# EAGLE design G020X (EAGLE 6.6.0)
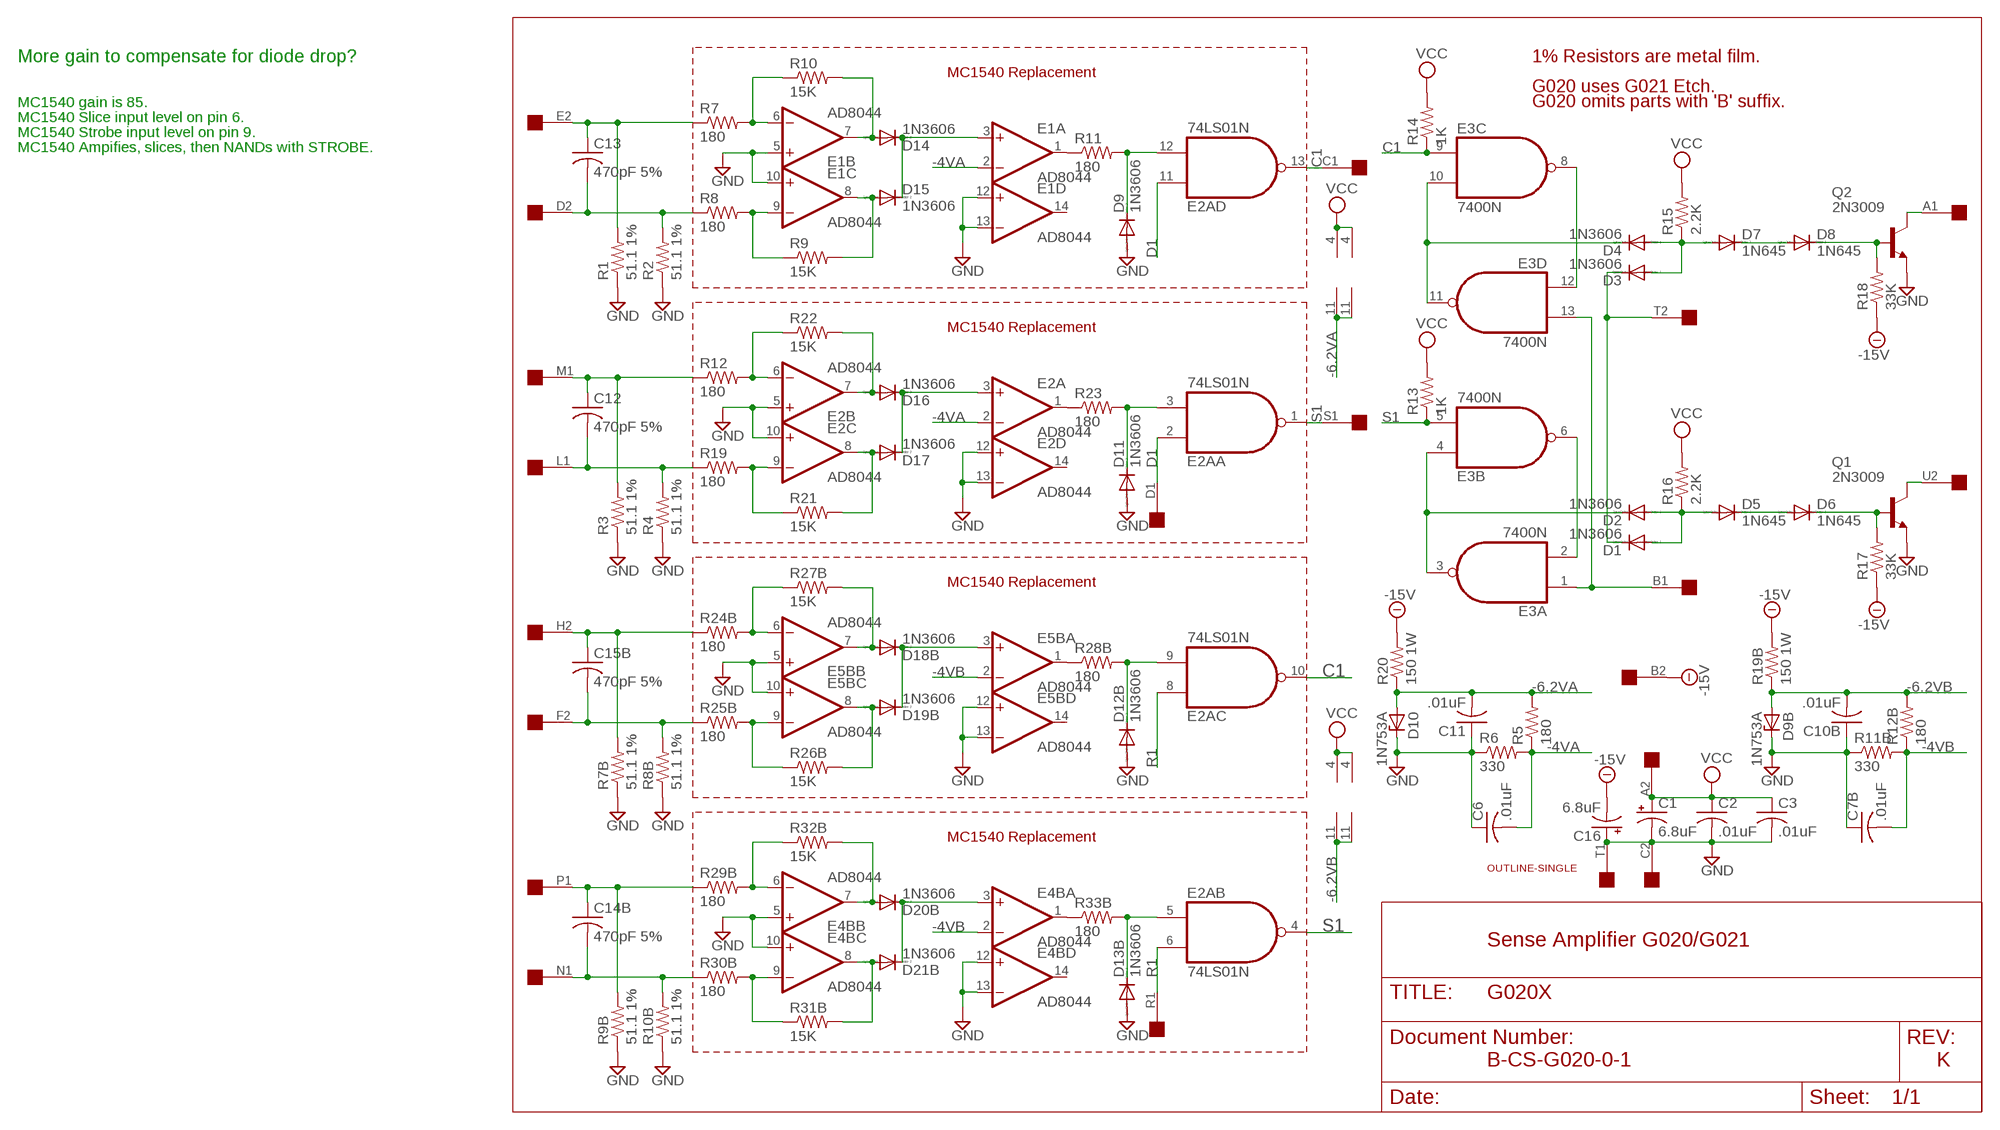
[diagram p0: schematic, sheet 1]

## Parts
C1  6.8uF  CPOL-USE20-8AXIAL  [E12-8]
C2  .01uF  C-US050-025X075  [C050-025X075]
C3  .01uF  C-US050-025X075  [C050-025X075]
C6  .01uF  C-US050-025X075  [C050-025X075]
C7B  .01uF  C-US050-025X075  [C050-025X075]
C10B  .01uF  C-US050-025X075  [C050-025X075]
C11  .01uF  C-US050-025X075  [C050-025X075]
C12  470pF 5%  C-US050-025X075  [C050-025X075]
C13  470pF 5%  C-US050-025X075  [C050-025X075]
C14B  470pF 5%  C-US050-025X075  [C050-025X075]
C15B  470pF 5%  C-US050-025X075  [C050-025X075]
C16  6.8uF  CPOL-USE20-8AXIAL  [E12-8]
D1  1N3606  1N4148DO35-10  [DO35-10]
D2  1N3606  1N4148DO35-10  [DO35-10]
D3  1N3606  1N4148DO35-10  [DO35-10]
D4  1N3606  1N4148DO35-10  [DO35-10]
D5  1N645  1N4148DO35-10  [DO35-10]
D6  1N645  1N4148DO35-10  [DO35-10]
D7  1N645  1N4148DO35-10  [DO35-10]
D8  1N645  1N4148DO35-10  [DO35-10]
D9  1N3606  1N4148DO35-10  [DO35-10]
D9B  1N753A  ZENER-DIODEDO35Z10  [DO35Z10]
D10  1N753A  ZENER-DIODEDO35Z10  [DO35Z10]
D11  1N3606  1N4148DO35-10  [DO35-10]
D12B  1N3606  1N4148DO35-10  [DO35-10]
D13B  1N3606  1N4148DO35-10  [DO35-10]
D14  1N3606  1N4148DO35-10  [DO35-10]
D15  1N3606  1N4148DO35-10  [DO35-10]
D16  1N3606  1N4148DO35-10  [DO35-10]
D17  1N3606  1N4148DO35-10  [DO35-10]
D18B  1N3606  1N4148DO35-10  [DO35-10]
D19B  1N3606  1N4148DO35-10  [DO35-10]
D20B  1N3606  1N4148DO35-10  [DO35-10]
D21B  1N3606  1N4148DO35-10  [DO35-10]
E1  AD8044  4AMP_P4+11N  [DIL14]
E2  AD8044  4AMP_P4+11N  [DIL14]
E2A  74LS01N  [DIL14]
E3  7400N  [DIL14]
E4B  AD8044  4AMP_P4+11N  [DIL14]
E5B  AD8044  4AMP_P4+11N  [DIL14]
Q1  2N3009  2N2219  [TO5]
Q2  2N3009  2N2219  [TO5]
R1  51.1 1%  R-US_0207/10  [0207/10]
R2  51.1 1%  R-US_0207/10  [0207/10]
R3  51.1 1%  R-US_0207/10  [0207/10]
R4  51.1 1%  R-US_0207/10  [0207/10]
R5  180  R-US_0207/10  [0207/10]
R6  330  R-US_0207/10  [0207/10]
R7  180  R-US_0207/10  [0207/10]
R7B  51.1 1%  R-US_0207/10  [0207/10]
R8  180  R-US_0207/10  [0207/10]
R8B  51.1 1%  R-US_0207/10  [0207/10]
R9  15K  R-US_0207/10  [0207/10]
R9B  51.1 1%  R-US_0207/10  [0207/10]
R10  15K  R-US_0207/10  [0207/10]
R10B  51.1 1%  R-US_0207/10  [0207/10]
R11  180  R-US_0207/10  [0207/10]
R11B  330  R-US_0207/10  [0207/10]
R12  180  R-US_0207/10  [0207/10]
R12B  180  R-US_0207/10  [0207/10]
R13  1K  R-US_0207/10  [0207/10]
R14  1K  R-US_0207/10  [0207/10]
R15  2.2K  R-US_0207/10  [0207/10]
R16  2.2K  R-US_0207/10  [0207/10]
R17  33K  R-US_0207/10  [0207/10]
R18  33K  R-US_0207/10  [0207/10]
R19  180  R-US_0207/10  [0207/10]
R19B  150 1W  R-US_0414/20  [0414/20]
R20  150 1W  R-US_0414/20  [0414/20]
R21  15K  R-US_0207/10  [0207/10]
R22  15K  R-US_0207/10  [0207/10]
R23  180  R-US_0207/10  [0207/10]
R24B  180  R-US_0207/10  [0207/10]
R25B  180  R-US_0207/10  [0207/10]
R26B  15K  R-US_0207/10  [0207/10]
R27B  15K  R-US_0207/10  [0207/10]
R28B  180  R-US_0207/10  [0207/10]
R29B  180  R-US_0207/10  [0207/10]
R30B  180  R-US_0207/10  [0207/10]
R31B  15K  R-US_0207/10  [0207/10]
R32B  15K  R-US_0207/10  [0207/10]
R33B  180  R-US_0207/10  [0207/10]
U$1  SINGLE  [EDGE-CON2]
U$2  OUTLINE-SINGLE  [SINGLE]

## Nets
-4VA: C6.2 E1.2(A:-IN) E2.2(A:-IN) R5.1 R6.2
-4VB: C7B.2 E4B.2(A:-IN) E5B.2(A:-IN) R11B.2 R12B.1
-6.2VA: C11.2 D10.A E1.11(P:V-) E2.11(P:V-) R5.2 R20.1
-6.2VB: C10B.2 D9B.A E4B.11(P:V-) E5B.11(P:V-) R12B.2 R19B.1
-15V [Supply]: C16.- R17.1 R18.1 R19B.2 R20.2 U$1.B2
A1: Q2.3(C) U$1.A1
B1: E3.1(A:I0) E3.13(D:I1) U$1.B1
C1: E2A.10(C:O) E2A.13(D:O) E3.9(C:I0) R14.1 U$1.C1
D1: E2A.2(A:I0) E2A.11(D:I0) U$1.D1
D2: C13.2 R2.2 R8.1 U$1.D2
E2: C13.1 R1.2 R7.1 U$1.E2
F2: C15B.2 R8B.2 R25B.1 U$1.F2
GND [Supply]: C1.- C2.2 C3.2 C6.1 C7B.1 C10B.1 C11.1 C16.+ D9.A D9B.C D10.C D11.A D12B.A D13B.A E1.5(B:+IN) E1.10(C:+IN) E1.12(D:+IN) E1.13(D:-IN) E2.5(B:+IN) E2.10(C:+IN) E2.12(D:+IN) E2.13(D:-IN) E4B.5(B:+IN) E4B.10(C:+IN) E4B.12(D:+IN) E4B.13(D:-IN) E5B.5(B:+IN) E5B.10(C:+IN) E5B.12(D:+IN) E5B.13(D:-IN) Q1.1(E) Q2.1(E) R1.1 R2.1 R3.1 R4.1 R6.1 R7B.1 R8B.1 R9B.1 R10B.1 R11B.1 U$1.C2 U$1.T1
H2: C15B.1 R7B.2 R24B.1 U$1.H2
L1: C12.2 R4.2 R19.1 U$1.L1
M1: C12.1 R3.2 R12.1 U$1.M1
N1: C14B.2 R10B.2 R30B.1 U$1.N1
N$1: D20B.C D21B.C E4B.3(A:+IN)
N$2: D18B.C D19B.C E5B.3(A:+IN)
N$5: E3.8(C:O) E3.12(D:I0)
N$6: D1.A D2.A D5.A R16.1
N$7: D4.C E3.10(C:I1) E3.11(D:O)
N$8: D2.C E3.3(A:O) E3.4(B:I0)
N$9: E3.2(A:I1) E3.6(B:O)
N$10: D3.A D4.A D7.A R15.1
N$11: D7.C D8.A
N$12: D5.C D6.A
N$13: D8.C Q2.2(B) R18.2
N$14: D6.C Q1.2(B) R17.2
N$15: E1.6(B:-IN) R7.2 R10.1
N$16: E1.9(C:-IN) R8.2 R9.1
N$17: D14.C D15.C E1.3(A:+IN)
N$19: E1.1(A:OUT) R11.1
N$20: D9.C E2A.12(D:I1) R11.2
N$21: D15.A E1.8(C:OUT) R9.2
N$22: E2.6(B:-IN) R12.2 R22.1
N$23: E2.9(C:-IN) R19.2 R21.1
N$24: D16.A E2.7(B:OUT) R22.2
N$26: E2.1(A:OUT) R23.1
N$27: D11.C E2A.3(A:I1) R23.2
N$29: E5B.6(B:-IN) R24B.2 R27B.1
N$30: E5B.9(C:-IN) R25B.2 R26B.1
N$31: D18B.A E5B.7(B:OUT) R27B.2
N$32: D14.A E1.7(B:OUT) R10.2
N$33: E5B.1(A:OUT) R28B.1
N$34: D12B.C E2A.9(C:I1) R28B.2
N$35: D17.A E2.8(C:OUT) R21.2
N$36: E4B.6(B:-IN) R29B.2 R32B.1
N$37: D19B.A E5B.8(C:OUT) R26B.2
N$38: D20B.A E4B.7(B:OUT) R32B.2
N$39: E4B.1(A:OUT) R33B.1
N$40: E4B.9(C:-IN) R30B.2 R31B.1
N$41: D13B.C E2A.5(B:I0) R33B.2
N$42: D16.C D17.C E2.3(A:+IN)
N$43: D21B.A E4B.8(C:OUT) R31B.2
P1: C14B.1 R9B.2 R29B.1 U$1.P1
R1: E2A.6(B:I1) E2A.8(C:I0) U$1.R1
S1: E2A.1(A:O) E2A.4(B:O) E3.5(B:I1) R13.1 U$1.S1
T2: D1.C D3.C U$1.T2
U2: Q1.3(C) U$1.U2
VCC [Supply]: C1.+ C2.1 C3.1 E1.4(P:V+) E2.4(P:V+) E4B.4(P:V+) E5B.4(P:V+) R13.2 R14.2 R15.2 R16.2 U$1.A2
Unconnected: E1.14(D:OUT) E2.14(D:OUT) E4B.14(D:OUT) E5B.14(D:OUT) U$1.E1 U$1.F1 U$1.H1 U$1.J1 U$1.J2 U$1.K1 U$1.K2 U$1.L2 U$1.M2 U$1.N2 U$1.P2 U$1.R2 U$1.S2 U$1.U1 U$1.V1 U$1.V2

## Notes on the sheet
- More gain to compensate for diode drop? | 1% Resistors are metal film.
- MC1540 Replacement
- G020 uses G021 Etch.
- MC1540 gain is 85. | G020 omits parts with 'B' suffix.
- MC1540 Slice input level on pin 6.
- MC1540 Strobe input level on pin 9.
- MC1540 Ampifies, slices, then NANDs with STROBE.
- MC1540 Replacement
- MC1540 Replacement
- MC1540 Replacement
- Sense Amplifier G020/G021
- B-CS-G020-0-1 | K

## Power pins joined to a net without a drawn wire
GND: E2A.7(P:GND) E3.7(P:GND)
VCC: E2A.14(P:VCC) E3.14(P:VCC)

## Library data of the parts
C1 C16 = dec-con:CPOL-USE20-8AXIAL: A 0.8 inch electrolytic.
C2 C3 C6 C7B C10B C11-C13 C14B C15B = rcl:C-US: CAPACITOR, American symbol
D1-D9 D11 D12B D13B D14-D17 D18B D19B D20B D21B = diode:1N4148: DIODE high speed (Philips)
D9B D10 = diode:ZENER-DIODE: Z-Diode
E1 E2 E4B E5B = linear:4AMP_P4+11: OP AMP
E2A = 74xx-us:74*01: Quad 2-input NAND gate, open collector
E3 = 74xx-us:74*00: Quad 2-input NAND gate
Q1 Q2 = transistor-npn:2N2219: NPN Transistor
R1-R7 R7B R8 R8B R9 R9B R10 R10B R11 R11B R12 R12B R13-R19 R21-R23 R24B R25B R26B R27B R28B R29B R30B R31B R32B R33B = rcl:R-US_: RESISTOR, American symbol
R19B R20 = dec-con:R-US_0414/20: 0.8" Resistor
U$1 = dec-con:SINGLE: Single-Height DEC board
U$2 = dec-con:OUTLINE-*: Board outlines for DEC boards.

## Net classes
1 Supply: width 0.813 mm

## Board
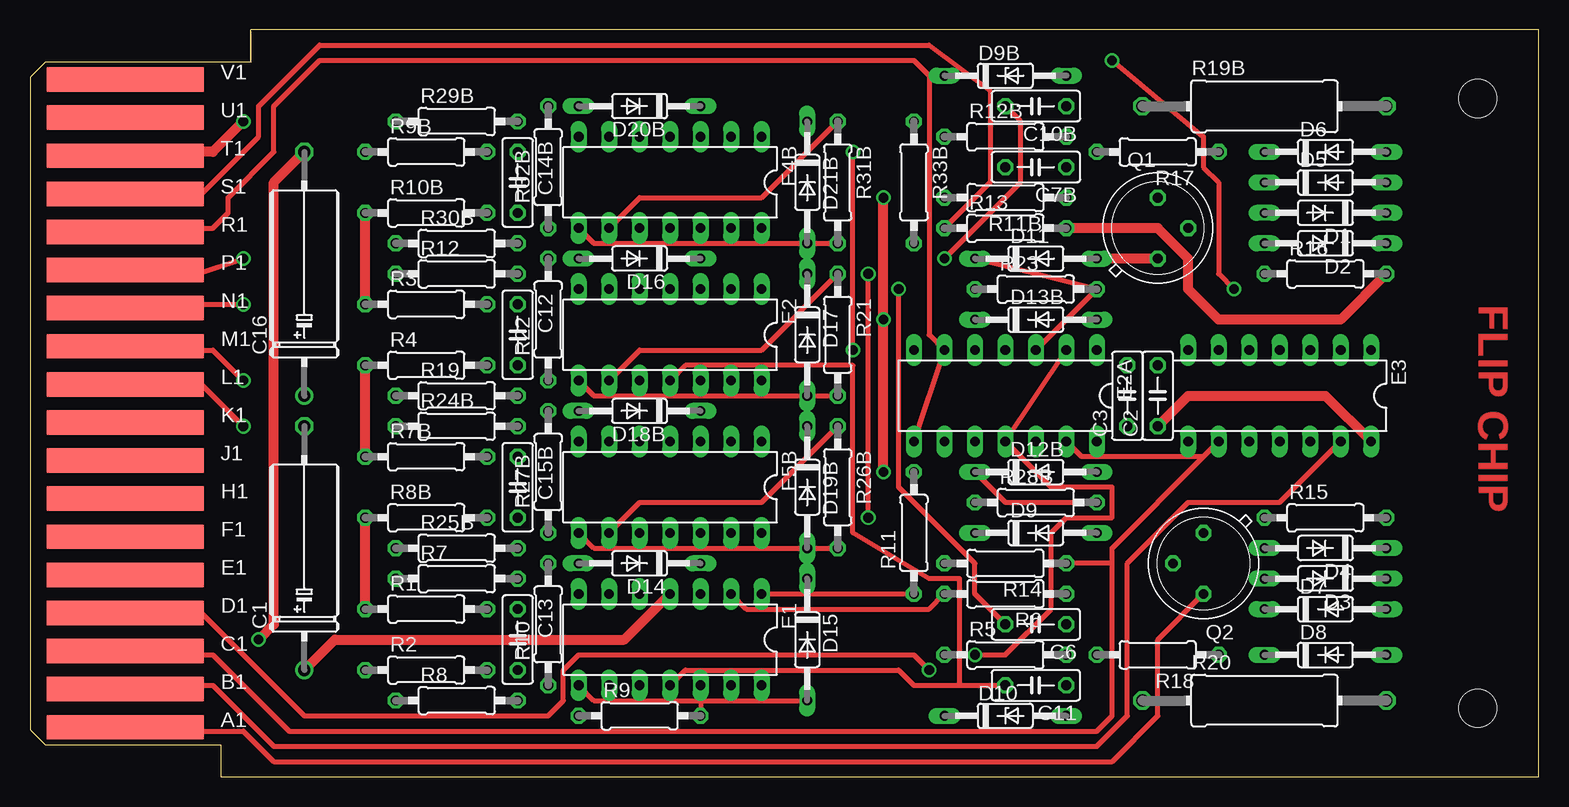
[diagram p1: board, top side]
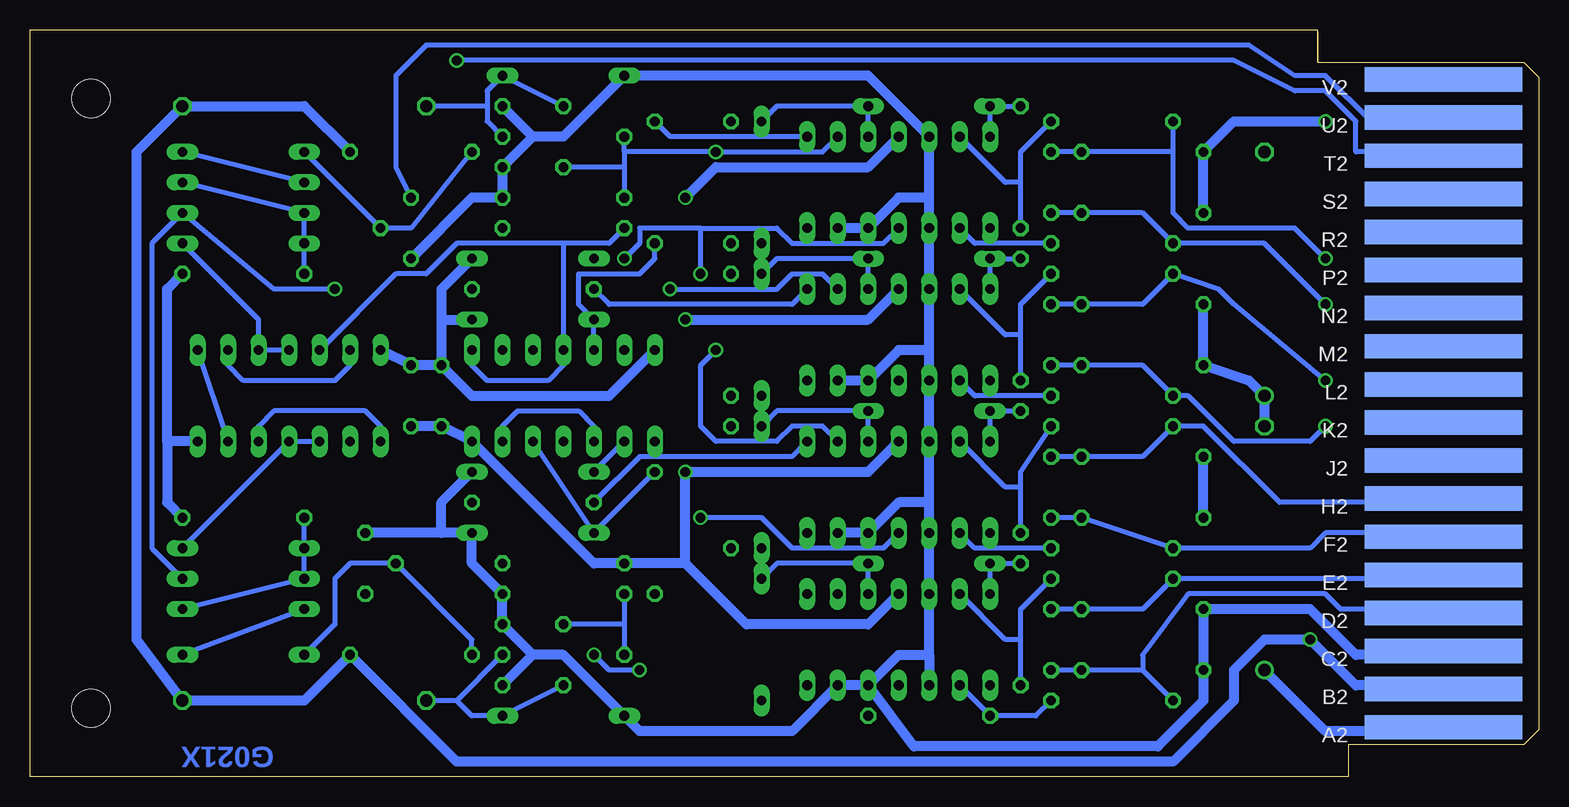
[diagram p2: board, bottom side, seen from below]

Size 125.73 x 62.23 mm. Coordinates in mm from the lower left corner, seen from the top.
Copper layers (1+2+16): Top 0.035mm / dielectric 1.5mm / ECO 0.035mm / dielectric 0.15mm / Bottom 0.035mm
Design rules "16mils": minimum track width 16mil, minimum drill 32mil, track to track 15mil, track to pad 10mil, pad to pad 10mil, via to via 10mil, smd to smd 10mil, copper to edge 13mil, drill to drill 10mil, minimum pad ring 10mil, minimum via ring 8mil, stop-mask expansion 0mil, vias tented up to drill 0mil, thermal gap 10mil

### Footprints (pad centres in the part's own frame; a part is rotated, then mirrored left to right if it is on the bottom)
E12-8 = drill 1.016: + -10.16,0 | drill 1.016 octagon: - 10.16,0
C050-025X075 = drill 0.813 octagon: 1 -2.54,0; 2 2.54,0
DO35-10 = drill 0.813 long: A 5.08,0; C -5.08,0
DO35Z10 = drill 0.813 long: A 5.08,0; C -5.08,0
DIL14 = drill 0.813 long: 1 -7.62,-3.81; 2 -5.08,-3.81; 3 -2.54,-3.81; 4 0,-3.81; 5 2.54,-3.81; 6 5.08,-3.81; 7 7.62,-3.81; 8 7.62,3.81; 9 5.08,3.81; 10 2.54,3.81; 11 0,3.81; 12 -2.54,3.81; 13 -5.08,3.81; 14 -7.62,3.81
TO5 = drill 0.813 octagon: 1 0,-2.54; 2 2.54,0; 3 0,2.54
0207/10 = drill 0.813 octagon: 1 -5.08,0; 2 5.08,0
0414/20 = drill 1.016 octagon: 1 -10.16,0; 2 10.16,0
EDGE-CON2 = smd 13.106 x 2.032: A1 7.938,4.128; B1 7.938,7.303; C1 7.938,10.477; D1 7.938,13.652; E1 7.938,16.828; F1 7.938,20.003; H1 7.938,23.177; J1 7.938,26.352; K1 7.938,29.527; L1 7.938,32.703; M1 7.938,35.877; N1 7.938,39.053; P1 7.938,42.227; R1 7.938,45.403; S1 7.938,48.578; T1 7.938,51.752; U1 7.938,54.928; V1 7.938,58.102 | smd 13.106 x 2.032 bottom: A2 7.938,4.128; B2 7.938,7.303; C2 7.938,10.477; D2 7.938,13.652; E2 7.938,16.828; F2 7.938,20.003; H2 7.938,23.177; J2 7.938,26.352; K2 7.938,29.527; L2 7.938,32.703; M2 7.938,35.877; N2 7.938,39.053; P2 7.938,42.227; R2 7.938,45.403; S2 7.938,48.578; T2 7.938,51.752; U2 7.938,54.928; V2 7.938,58.102
SINGLE = hole 3.175: 120.65,56.515; 120.65,5.715

### Placement (x,y rotation side)
C1  22.86,19.05 90 top
C2  93.98,31.75 90 top
C3  91.44,31.75 90 top
C6  83.82,12.7 180 top
C7B  83.82,50.8 180 top
C10B  83.82,55.88 180 top
C11  83.82,7.62 180 top
C12  40.64,36.83 270 top
C13  40.64,11.43 270 top
C14B  40.64,49.53 270 top
C15B  40.64,24.13 270 top
C16  22.86,41.91 90 top
D1  107.95,46.99 180 top
D2  107.95,44.45 180 top
D3  107.95,16.51 180 top
D4  107.95,19.05 180 top
D5  107.95,49.53 0 top
D6  107.95,52.07 0 top
D7  107.95,13.97 0 top
D8  107.95,10.16 0 top
D9  83.82,20.32 0 top
D9B  81.28,58.42 0 top
D10  81.28,5.08 0 top
D11  83.82,43.18 0 top
D12B  83.82,25.4 0 top
D13B  83.82,38.1 0 top
D14  50.8,17.78 180 top
D15  64.77,11.43 270 top
D16  50.8,43.18 180 top
D17  64.77,36.83 270 top
D18B  50.8,30.48 180 top
D19B  64.77,24.13 270 top
D20B  50.8,55.88 180 top
D21B  64.77,49.53 270 top
E1  53.34,11.43 180 top
E2  53.34,36.83 180 top
E2A  81.28,31.75 180 top
E3  104.14,31.75 180 top
E4B  53.34,49.53 180 top
E5B  53.34,24.13 180 top
Q1  93.98,45.72 0 top
Q2  97.79,17.78 180 top
R1  33.02,13.97 0 top
R2  33.02,8.89 0 top
R3  33.02,39.37 0 top
R4  33.02,34.29 0 top
R5  81.28,10.16 0 top
R6  81.28,15.24 180 top
R7  35.56,16.51 0 top
R7B  33.02,26.67 0 top
R8  35.56,6.35 0 top
R8B  33.02,21.59 0 top
R9  50.8,5.08 0 top
R9B  33.02,52.07 0 top
R10  43.18,12.7 90 top
R10B  33.02,46.99 0 top
R11  73.66,20.32 90 top
R11B  81.28,48.26 180 top
R12  35.56,41.91 0 top
R12B  81.28,53.34 0 top
R13  81.28,45.72 0 top
R14  81.28,17.78 180 top
R15  107.95,21.59 0 top
R16  107.95,41.91 0 top
R17  93.98,52.07 180 top
R18  93.98,10.16 180 top
R19  35.56,31.75 0 top
R19B  102.87,55.88 0 top
R20  102.87,6.35 0 top
R21  67.31,36.83 270 top
R22  43.18,38.1 90 top
R23  83.82,40.64 0 top
R24B  35.56,29.21 0 top
R25B  35.56,19.05 0 top
R26B  67.31,24.13 270 top
R27B  43.18,25.4 90 top
R28B  83.82,22.86 0 top
R29B  35.56,54.61 0 top
R30B  35.56,44.45 0 top
R31B  67.31,49.53 270 top
R32B  43.18,50.8 90 top
R33B  73.66,49.53 270 top
U$1  0,0 0 top
U$2  0,0 0 top

### Tracks (layer width: path | path; a pad name or v marks a point on that pad's centre or on a via)
-4VA  (via drill 0.81)
  Top 0.406: E1.2 59.69,13.97 74.93,13.97 R6.2 | v72.39,40.64 72.39,24.13 78.74,17.78 78.74,15.24 C6.2
  Bottom 0.406: R5.1 R6.2 76.2,12.7 C6.2 | E2.2 59.69,41.91 62.23,41.91 63.5,40.64 v72.39,40.64
-4VB  (via drill 0.81)
  Top 0.406: v68.58,35.56 v68.58,52.07
  Bottom 0.406: 76.2,50.8 C7B.2 | 76.2,50.8 R11B.2 | 76.2,52.07 76.2,50.8 | 76.2,52.07 R12B.1 | E4B.2 59.69,52.07 v68.58,52.07 76.2,52.07 | E5B.2 59.69,29.21 62.23,29.21 63.5,27.94 68.58,27.94 69.85,29.21 69.85,34.29 v68.58,35.56
-6.2VA
  Top 0.406: E1.11 54.61,8.89 72.39,8.89 73.66,7.62 77.47,7.62 | 77.47,7.62 C11.2 | E2.11 54.61,34.29 68.58,34.29 68.58,20.32 74.93,16.51 77.47,16.51 77.47,7.62
  Bottom 0.406: C11.2 D10.A 88.9,5.08 90.17,6.35 | 90.17,6.35 R20.1 | 90.17,6.35 R5.2
-6.2VB  (via drill 0.81)
  Top 0.406: v69.85,21.59 v69.85,41.91 | C10B.2 82.55,54.61 82.55,49.53 v76.2,43.18
  Bottom 0.406: 87.63,55.88 87.63,57.15 D9B.A C10B.2 | 87.63,55.88 R19B.1 | R12B.2 87.63,54.61 87.63,55.88 | E5B.11 54.61,19.05 62.23,19.05 64.77,21.59 v69.85,21.59 | v69.85,41.91 69.85,45.72 | 69.85,45.72 63.5,45.72 62.23,44.45 54.61,44.45 E4B.11 | v76.2,43.18 74.93,44.45 74.93,45.72 69.85,45.72
-15V  (via drill 0.81)
  Top 0.813: C16.- 20.32,49.53 20.32,12.7 v19.05,11.43
  Bottom 0.813: U$1.B2 8.89,7.62 15.24,7.62 v19.05,11.43 22.86,11.43 25.4,8.89 25.4,6.35 30.48,1.27 90.17,1.27 R18.1 102.87,6.35 R20.2 116.84,11.43 116.84,52.07 R19B.2 102.87,55.88 R17.1
A1
  Top 0.406: Q2.3 93.98,11.43 93.98,5.08 90.17,1.27 20.32,1.27 17.78,3.81 8.89,3.81 U$1.A1
B1
  Top 0.406: U$1.B1 8.89,7.62 15.24,7.62 20.32,2.54 88.9,2.54 91.44,5.08 91.44,17.78 96.52,22.86 104.14,22.86 E3.13
  Bottom 0.406: E3.13 E3.1
C1
  Top 0.406: 90.17,17.78 90.17,19.05 97.79,26.67 | 97.79,26.67 E3.9 | U$1.C1 8.89,10.16 15.24,10.16 21.59,3.81 88.9,3.81 90.17,5.08 90.17,17.78 | 90.17,17.78 R14.1 | E2A.13 87.63,26.67 97.79,26.67
  Bottom 0.406: E2A.10 78.74,29.21 80.01,30.48 85.09,30.48 86.36,29.21 E2A.13
D1  (via drill 0.81)
  Top 0.406: E2A.2 E2A.11 85.09,24.13 90.17,24.13 90.17,21.59 86.36,21.59 85.09,20.32 85.09,13.97 81.28,10.16 v78.74,10.16 | U$1.D1 8.26,13.97 13.97,13.97 22.86,5.08 43.18,5.08 44.45,6.35 44.45,8.89 45.72,10.16 73.66,10.16 v74.93,8.89
  Bottom 0.406: v78.74,10.16 77.47,8.89 v74.93,8.89
D2
  Bottom 0.406: R2.2 C13.2 | U$1.D2 8.89,13.97 16.51,13.97 17.78,15.24 29.21,15.24 33.02,10.16 33.02,8.89 | R2.2 C13.2 | R2.2 C13.2 | 33.02,8.89 R2.2 | 33.02,8.89 R8.1
E2
  Bottom 0.406: R1.2 C13.1 R1.2 | U$1.E2 8.89,16.51 R7.1 33.02,13.97 R1.2
F2
  Bottom 0.406: U$1.F2 8.89,20.32 17.78,20.32 19.05,19.05 R25B.1 R8B.2 | R8B.2 C15B.2 R8B.2
GND  (via drill 0.81)
  Top 0.813: R1.1 R8B.1 | R7B.1 R4.1 | R3.1 R10B.1 | Q1.1 D11.A | U$1.T1 8.26,52.07 15.24,52.07 v17.78,54.61
  Bottom 0.813: E1.12 52.07,2.54 31.75,2.54 27.94,6.35 R2.1 R1.1 19.05,13.97 15.24,10.16 8.89,10.16 U$1.C2 | E1.12 E1.13 | E1.13 62.23,3.81 74.93,3.81 D10.C 81.28,10.16 83.82,10.16 | R8B.1 R7B.1 | C1.- C16.+ 24.13,33.02 R4.1 R3.1 | R10B.1 R9B.1 25.4,54.61 v17.78,54.61 | E3.7 C2.2 C3.2 | C7B.1 R11B.1 | C6.1 R6.1 | C6.1 R6.1 | R6.1 88.9,17.78 D9.A | C6.1 R6.1 | 83.82,10.16 C11.1 | 83.82,10.16 C6.1 | C6.1 R6.1 | 83.82,53.34 81.28,53.34 D9B.C 55.88,58.42 E4B.5 50.8,48.26 | C7B.1 R11B.1 | 83.82,53.34 C7B.1 | 83.82,53.34 C10B.1 | E1.12 E1.13 | E1.12 E1.13 | E1.12 53.34,10.16 50.8,10.16 | 50.8,10.16 E1.10 | 50.8,10.16 E1.5 E5B.10 50.8,22.86 | R11B.1 88.9,48.26 Q1.1 | C7B.1 R11B.1 | C7B.1 R11B.1 | 50.8,22.86 E5B.5 E2.10 50.8,35.56 | 50.8,35.56 E2.5 E4B.10 50.8,48.26 | E4B.13 E4B.12 53.34,48.26 50.8,48.26 | E2.13 E2.12 53.34,35.56 50.8,35.56 | E5B.13 E5B.12 53.34,22.86 50.8,22.86 | E2A.7 77.47,31.75 88.9,31.75 C3.2 | D11.A 91.44,40.64 91.44,38.1 | 91.44,38.1 D13B.A | 91.44,38.1 C3.2 | D9.A 91.44,20.32 91.44,22.86 D12B.A | D9.A Q2.1
H2
  Bottom 0.406: U$1.H2 8.89,22.86 21.59,22.86 27.94,29.21 R24B.1 33.02,26.67 R7B.2 | R7B.2 C15B.1 R7B.2
L1  (via drill 0.81)
  Top 0.406: U$1.L1 8.89,33.02 13.97,33.02 v17.78,29.21
  Bottom 0.406: R4.2 33.02,34.29 R19.1 29.21,31.75 25.4,27.94 19.05,27.94 v17.78,29.21 | R4.2 C12.2 R4.2
M1  (via drill 0.81)
  Top 0.406: U$1.M1 10.16,35.56 15.24,35.56 v17.78,33.02
  Bottom 0.406: R3.2 C12.1 R3.2 | R3.2 33.02,39.37 R12.1 26.67,40.64 25.4,39.37 v17.78,33.02
N1  (via drill 0.81)
  Top 0.406: U$1.N1 8.89,39.37 v17.78,39.37
  Bottom 0.406: R10B.2 C14B.2 R10B.2 | R10B.2 33.02,46.99 R30B.1 22.86,44.45 v17.78,39.37
N$1
  Bottom 0.406: D21B.C 63.5,55.88 D20B.C E4B.3
N$2
  Bottom 0.406: E5B.3 D18B.C 63.5,30.48 D19B.C
N$5
  Bottom 0.406: E3.8 96.52,29.21 97.79,30.48 105.41,30.48 106.68,29.21 E3.12
N$6
  Bottom 0.406: D5.A D1.A D2.A R16.1
N$7
  Bottom 0.406: E3.10 E3.11 D4.C
N$8
  Bottom 0.406: E3.4 E3.3 106.68,38.1 D2.C
N$9
  Bottom 0.406: E3.6 99.06,34.29 100.33,33.02 107.95,33.02 109.22,34.29 E3.2
N$10
  Bottom 0.406: R15.1 D4.A D3.A D7.A
N$11
  Bottom 0.406: D7.C D8.A
N$12
  Bottom 0.406: D5.C D6.A
N$13
  Bottom 0.406: D8.C 100.33,12.7 100.33,16.51 99.06,17.78 Q2.2 88.9,11.43 R18.2
N$14
  Bottom 0.406: R17.2 93.98,45.72 Q1.2 D6.C
N$15
  Bottom 0.406: R7.2 43.18,13.97 43.18,10.16 | 43.18,10.16 43.18,11.43 44.45,11.43 E1.6 | R10.1 43.18,10.16
N$16
  Bottom 0.406: R8.2 41.91,5.08 R9.1 E1.9
N$17
  Bottom 0.406: E1.3 D14.C 63.5,17.78 D15.C
N$19
  Top 0.406: E1.1 R11.1
N$20
  Bottom 0.406: E2A.12 D9.C R11.2
N$21
  Top 0.406: E1.8 46.99,6.35 55.88,6.35 | 55.88,6.35 D15.A | 55.88,6.35 R9.2
N$22
  Bottom 0.406: R22.1 43.18,35.56 | 43.18,35.56 43.18,36.83 44.45,36.83 E2.6 | R12.2 43.18,39.37 43.18,35.56
N$23
  Top 0.406: R21.1 60.96,35.56 50.8,35.56 E2.9
  Bottom 0.406: R19.2 46.99,31.75 E2.9
N$24
  Bottom 0.406: R22.2 D16.A E2.7
N$26
  Bottom 0.406: E2.1 62.23,39.37 77.47,39.37 R23.1
N$27
  Top 0.406: E2A.3 R23.2 D11.C
N$29
  Bottom 0.406: R27B.1 43.18,22.86 | 43.18,22.86 43.18,25.4 R24B.2 | 43.18,22.86 43.18,24.13 44.45,24.13 E5B.6
N$30
  Top 0.406: E5B.9 50.8,22.86 60.96,22.86 R26B.1
  Bottom 0.406: R25B.2 46.99,19.05 E5B.9
N$31
  Bottom 0.406: R27B.2 D18B.A E5B.7
N$32
  Bottom 0.406: E1.7 D14.A R10.2
N$33
  Bottom 0.406: R28B.1 74.93,26.67 62.23,26.67 E5B.1
N$34
  Top 0.406: R28B.2 81.28,22.86 D12B.C
  Bottom 0.406: E2A.9 D12B.C
N$35
  Top 0.406: R21.2 D17.A 46.99,31.75 E2.8
N$36
  Bottom 0.406: R29B.2 43.18,52.07 43.18,48.26 | R32B.1 43.18,48.26 | 43.18,48.26 43.18,49.53 44.45,49.53 E4B.6
N$37
  Top 0.406: R26B.2 D19B.A 46.99,19.05 E5B.8
N$38
  Bottom 0.406: R32B.2 D20B.A E4B.7
N$39
  Bottom 0.406: E4B.1 72.39,53.34 R33B.1
N$40
  Top 0.406: R31B.1 60.96,48.26 50.8,48.26 E4B.9
  Bottom 0.406: R30B.2 46.99,44.45 E4B.9
N$41
  Bottom 0.406: E2A.5 D13B.C 80.01,39.37 80.01,41.91 76.2,41.91 74.93,41.91 73.66,43.18 R33B.2
N$42
  Bottom 0.406: D17.C 63.5,43.18 D16.C E2.3
N$43
  Top 0.406: R31B.2 D21B.A 46.99,44.45 E4B.8
P1  (via drill 0.81)
  Top 0.406: U$1.P1 8.89,41.91 13.97,41.91 v17.78,43.18
  Bottom 0.406: R9B.2 C14B.1 R9B.2 | 30.48,52.07 R9B.2 | 30.48,52.07 30.48,46.99 29.21,45.72 20.32,45.72 v17.78,43.18 | 30.48,52.07 R29B.1
R1
  Top 0.406: U$1.R1 8.89,45.72 15.24,45.72 16.51,46.99 16.51,48.26 20.32,52.07 20.32,55.88 24.13,59.69 73.66,59.69 74.93,58.42 74.93,36.83 E2A.6 E2A.8
S1
  Top 0.406: R13.1 80.01,49.53 80.01,57.15 74.93,60.96 24.13,60.96 19.05,55.88 19.05,53.34 13.97,48.26 8.89,48.26 U$1.S1
  Bottom 0.406: R13.1 77.47,44.45 81.28,44.45 | 81.28,44.45 90.17,44.45 92.71,41.91 95.25,41.91 E3.5 | E2A.1 88.9,34.29 87.63,33.02 82.55,33.02 81.28,34.29 E2A.4 81.28,44.45
T2  (via drill 0.81)
  Top 0.406: v90.17,59.69 97.79,53.34 97.79,50.8 99.06,49.53 99.06,41.91 v100.33,40.64
  Bottom 0.406: U$1.T2 8.89,52.07 15.24,52.07 15.24,54.61 17.78,57.15 20.32,57.15 25.4,59.69 v90.17,59.69 | v100.33,40.64 105.41,40.64 D1.C 115.57,44.45 115.57,19.05 D3.C
U2
  Bottom 0.406: U$1.U2 8.89,54.61 13.97,54.61 17.78,58.42 20.32,58.42 24.13,60.96 92.71,60.96 95.25,58.42 95.25,50.8 Q1.3
VCC  (via drill 0.81)
  Top 0.813: C1.+ 25.4,11.43 49.53,11.43 E1.4 | E3.14 107.95,31.75 96.52,31.75 C2.1 | R13.2 93.98,45.72 96.52,43.18 96.52,40.64 99.06,38.1 109.22,38.1 R16.2 | v71.12,25.4 v71.12,38.1 v71.12,48.26
  Bottom 0.813: U$1.A2 8.89,3.81 17.78,3.81 C1.+ | 114.3,27.94 114.3,22.86 R15.2 | E3.14 114.3,27.94 | 114.3,27.94 114.3,40.64 R16.2 | C3.1 C2.1 C3.1 | C3.1 E2A.14 78.74,17.78 R14.2 71.12,17.78 | E1.4 55.88,12.7 66.04,12.7 71.12,17.78 | E5B.4 55.88,25.4 v71.12,25.4 71.12,17.78 | E4B.4 55.88,50.8 68.58,50.8 v71.12,48.26 | E2.4 55.88,38.1 v71.12,38.1

### Text on the board
Top: FLIP CHIP
Bottom: G021X